# EAGLE design owl-analog (EAGLE 7.5.0)
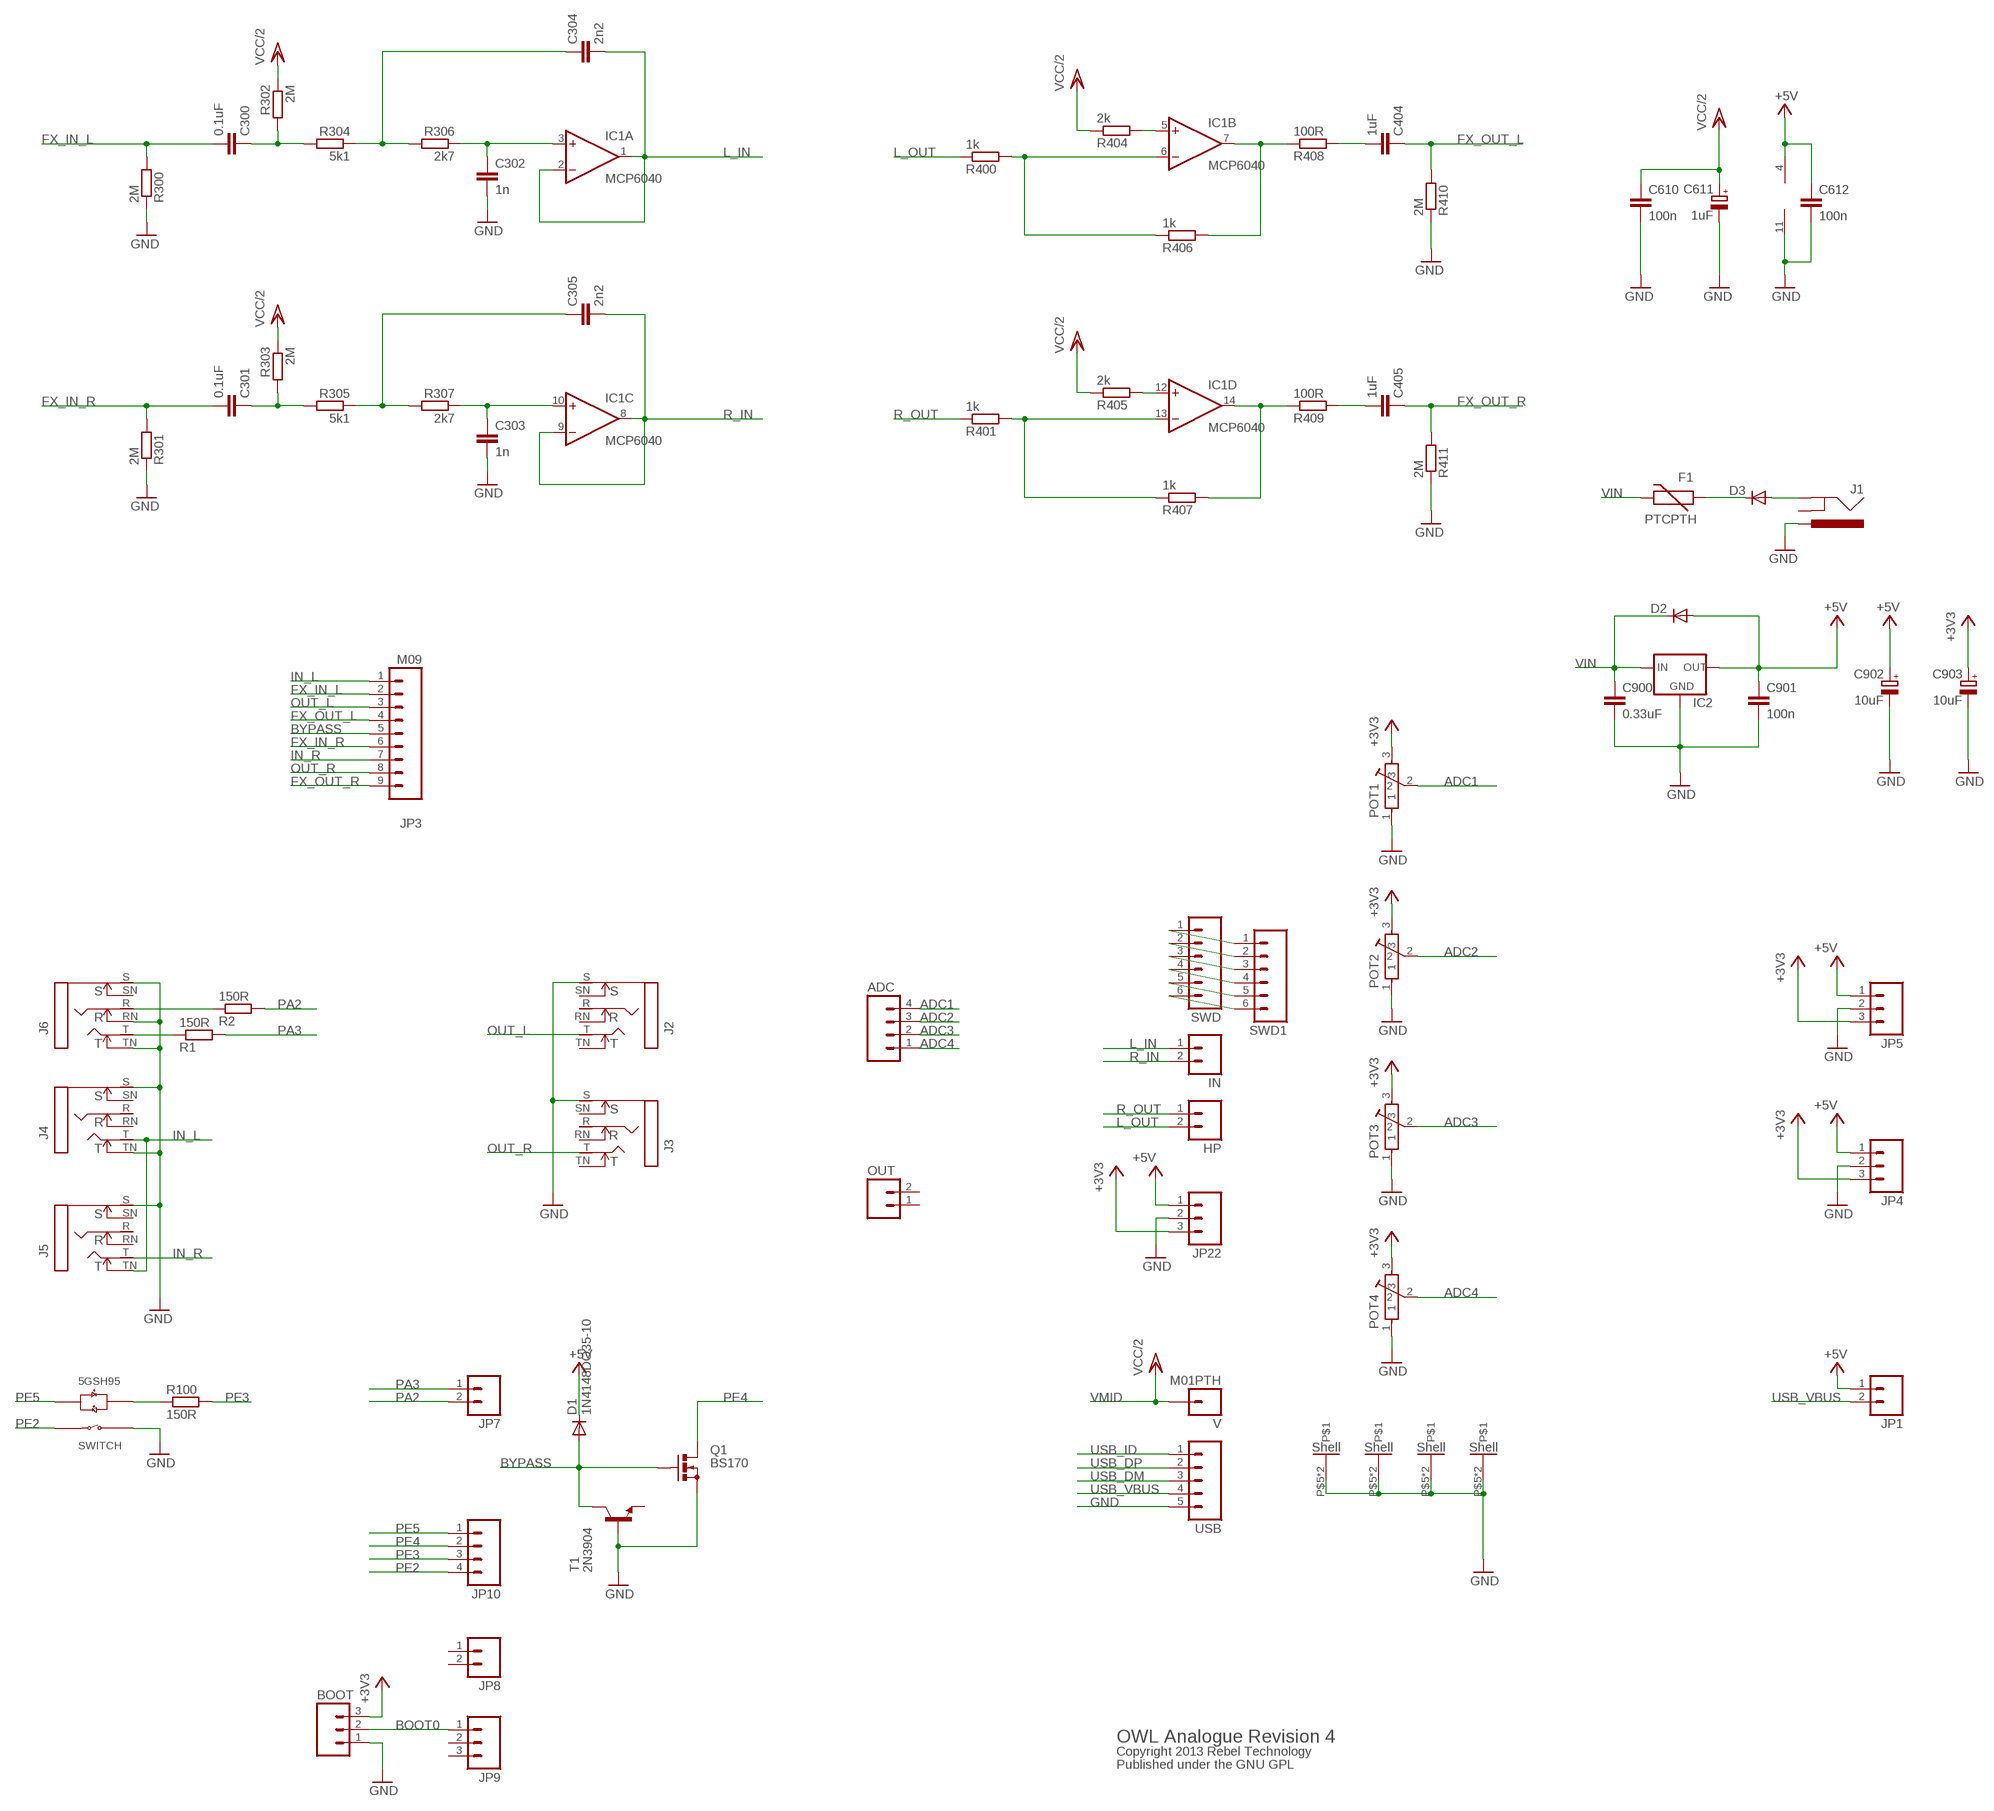
[diagram p0: schematic, sheet 1]

## Parts
ADC  M04PTH  [1X04]
BOOT  M03PTH  [1X03]
C300  0.1uF  C5/3.5  [C5B3.5]
C301  0.1uF  C5/3.5  [C5B3.5]
C302  1n  C5/2.5  [C5B2.5]
C303  1n  C5/2.5  [C5B2.5]
C304  2n2  C5/2.5  [C5B2.5]
C305  2n2  C-EU050-025X075  [C050-025X075]
C404  1uF  C5/5  [C5B5]
C405  1uF  C5/5  [C5B5]
C610  100n  C-EU050-025X075  [C050-025X075]
C611  1uF  CPOL-EUE2.5-7  [E2,5-7]
C612  100n  C-EU050-025X075  [C050-025X075]
C900  0.33uF  C-EU050-025X075  [C050-025X075]
C901  100n  C-EU050-025X075  [C050-025X075]
C902  10uF  CPOL-EUE2.5-7  [E2,5-7]
C903  10uF  CPOL-EUE2.5-7  [E2,5-7]
D1  1N4148DO35-10  [DO35-10]
D2  DIODE1N4001  [DIODE-1N4001]
D3  DIODE1N4001  [DIODE-1N4001]
F1  PTCPTH  [PTC]
HP  M02PTH  [1X02]
IC1  MCP6040  TL074P  [DIL14]
IC2  V_REG_78XX-TO-220  [TO-220-ALT]
IN  M02PTH  [1X02]
J1  POWER_JACKPTH  [POWER_JACK_PTH]
J2  NEUTRIK_NMJ6HCD2  [NMJ6HCD2]
J3  NEUTRIK_NMJ6HCD2  [NMJ6HCD2]
J4  NEUTRIK_NMJ6HCD2  [NMJ6HCD2]
J5  NEUTRIK_NMJ6HCD2  [NMJ6HCD2]
J6  NEUTRIK_NMJ6HCD2  [NMJ6HCD2]
JP1  M02PTH  [1X02]
JP3  M09  [1X09]
JP4  M03PTH  [1X03]
JP5  M03PTH  [1X03]
JP7  M02PTH  [1X02]
JP8  M02PTH  [1X02]
JP9  M03PTH  [1X03]
JP10  M04PTH  [1X04]
JP22  M03PTH  [1X03]
OUT  M02PTH  [1X02]
POT1  POT-ALPS-RK09L1140  [POT-ALPS-RK09L1140]
POT2  POT-ALPS-RK09L1140  [POT-ALPS-RK09L1140]
POT3  POT-ALPS-RK09L1140  [POT-ALPS-RK09L1140]
POT4  POT-ALPS-RK09L1140  [POT-ALPS-RK09L1140]
Q1  BS170  [SOT54E]
R1  150R  R-EU_0204/7  [0204/7]
R2  150R  R-EU_0204/7  [0204/7]
R100  150R  R-EU_0204/7  [0204/7]
R300  2M  R-EU_0204/7  [0204/7]
R301  2M  R-EU_0204/7  [0204/7]
R302  2M  R-EU_0204/7  [0204/7]
R303  2M  R-EU_0204/7  [0204/7]
R304  5k1  R-EU_0204/7  [0204/7]
R305  5k1  R-EU_0204/7  [0204/7]
R306  2k7  R-EU_0204/7  [0204/7]
R307  2k7  R-EU_0204/7  [0204/7]
R400  1k  R-EU_0204/7  [0204/7]
R401  1k  R-EU_0204/7  [0204/7]
R404  2k  R-EU_0204/7  [0204/7]
R405  2k  R-EU_0204/7  [0204/7]
R406  1k  R-EU_0204/7  [0204/7]
R407  1k  R-EU_0204/7  [0204/7]
R408  100R  R-EU_0204/7  [0204/7]
R409  100R  R-EU_0204/7  [0204/7]
R410  2M  R-EU_0204/7  [0204/7]
R411  2M  R-EU_0204/7  [0204/7]
SWD  M06SIP  [1X06]
SWD1  M06SIP  [1X06]
T1  2N3904  [TO92]
U$1  5GTH9  [5GTH9]
USB  M05PTH  [1X05]
V  M01PTH  [1X01]

## Nets
+3V3: BOOT.3 C903.+ JP4.3 JP5.3 JP22.3 POT1.3 POT2.3 POT3.3 POT4.3
+5V: C612.1 C901.1 C902.+ D1.C D2.A IC1.4(P:V+) IC2.OUT JP1.1 JP4.1 JP5.1 JP22.1
+5V/1: IC1.5(B:+IN) R404.2
ADC1: ADC.4 POT1.2
ADC2: ADC.3 POT2.2
ADC3: ADC.2 POT3.2
ADC4: ADC.1 POT4.2
BOOT0: BOOT.2 JP9.1
BYPASS: D1.A JP3.5 Q1.G T1.1(C)
FX_IN_L: C300.2 JP3.2 R300.2
FX_IN_R: C301.2 JP3.6 R301.2
FX_OUT_L: C404.1 JP3.4 R410.2
FX_OUT_R: C405.1 JP3.9 R411.2
GND: BOOT.1 C302.2 C303.2 C610.2 C611.- C612.2 C900.2 C901.2 C902.- C903.- IC1.11(P:V-) IC2.GND J1.PWR J2.S J3.S J4.S J4.TN J5.S J6.RN J6.S J6.TN JP4.2 JP5.2 JP22.2 POT1.1 POT1.P$5 POT1.P$6 POT2.1 POT2.P$5 POT2.P$6 POT3.1 POT3.P$5 POT3.P$6 POT4.1 POT4.P$5 POT4.P$6 Q1.S R300.1 R301.1 R410.1 R411.1 T1.2(B) U$1.1(SWITCH_B) USB.5
IN_L: J4.T J5.TN JP3.1
IN_R: J5.T JP3.7
L_IN: C304.2 IC1.1(A:OUT) IC1.2(A:-IN) IN.1
L_OUT: HP.2 R400.1
N$1: D3.A J1.GND
N$2: IC1.12(D:+IN) R405.2
N$3: SWD1.1 SWD.1
N$4: D3.C F1.P$1
N$5: SWD1.2 SWD.2
N$6: SWD1.3 SWD.3
N$7: SWD1.4 SWD.4
N$8: SWD1.5 SWD.5
N$9: SWD1.6 SWD.6
N$10: R100.1 U$1.+3(LED_R+)
N$12: J6.R R2.1
N$15: J6.T R1.1
N$26: C300.1 R302.2 R304.2
N$28: C405.2 R409.2
N$30: C301.1 R303.2 R305.2
N$32: C303.1 IC1.10(C:+IN) R307.1
N$33: C304.1 R304.1 R306.2
N$34: C305.1 R305.1 R307.2
N$35: C404.2 R408.2
N$36: C302.1 IC1.3(A:+IN) R306.1
N$39: IC1.7(B:OUT) R406.2 R408.1
N$40: IC1.14(D:OUT) R407.2 R409.1
N$41: IC1.6(B:-IN) R400.2 R406.1
N$42: IC1.13(D:-IN) R401.2 R407.1
OUT_L: J2.T JP3.3
OUT_R: J3.T JP3.8
PA2: JP7.2 R2.2
PA3: JP7.1 R1.2
PE2: JP10.4 U$1.4(SWITCH_A)
PE3: JP10.3 R100.2
PE4: JP10.2 Q1.D
PE5: JP10.1 U$1.-2(LED_G+)
R_IN: C305.2 IC1.8(C:OUT) IC1.9(C:-IN) IN.2
R_OUT: HP.1 R401.1
USB_DM: USB.3
USB_DP: USB.2
USB_ID: USB.1
USB_VBUS: JP1.2 USB.4
VIN: C900.1 D2.C F1.P$2 IC2.IN
VMID: C610.1 C611.+ R302.1 R303.1 R404.1 R405.1 V.1 ; supply symbol labelled VCC/2
Unconnected: J1.GNDBREAK J2.R J2.RN J2.SN J2.TN J3.R J3.RN J3.SN J3.TN J4.R J4.RN J4.SN J5.R J5.RN J5.SN J6.SN JP8.1 JP8.2 JP9.2 JP9.3 OUT.1 OUT.2 T1.3(E)

## Notes on the sheet
- OWL Analogue Revision 4
- Copyright 2013 Rebel Technology
- Published under the GNU GPL

## Library data of the parts
ADC JP10 = SparkFun:M04: Header 4 Standard 4-pin 0.1" header. Use with straight break away headers (SKU : PRT-00116), right angle break away headers (PRT-00553), swiss pins (PRT-00743), machine pins (PRT-00117), and female headers (PRT-00115). Molex polarized connector foot print use with SKU : PRT-08231 with associated crimp pins and housings. 1MM SMD Version SKU: PRT-10208
BOOT JP4 JP5 JP9 JP22 = SparkFun:M03: Header 3 Standard 3-pin 0.1" header. Use with straight break away headers (SKU : PRT-00116), right angle break away headers (PRT-00553), swiss pins (PRT-00743), machine pins (PRT-00117), and female headers (PRT-00115). Molex polarized connector foot print use with SKU : PRT-08232 with associated crimp pins and housings.
C300-C304 C404 C405 = capacitor-wima:C: CAPACITOR naming: grid - package width
C305 C610 C612 C900 C901 = rcl:C-EU: CAPACITOR, European symbol
C611 C902 C903 = rcl:CPOL-EU: POLARIZED CAPACITOR, European symbol
D1 = diode:1N4148: DIODE high speed (Philips)
D2 D3 = Rebel:DIODE: Diode These are standard reverse protection diodes and small signal diodes. SMA package can handle up to about 1A. SOD-323 can handle about 200mA. Watch the SOD-323 package when ordering, there are some mfgs out there that are 5-pin packages.
F1 = Rebel:PTC: Resettable Fuse PTC Resettable Fuse. Bourns MF-R, Raychem PolySwitch RXE.
HP IN JP1 JP7 JP8 OUT = SparkFun:M02: Header 2 Standard 2-pin 0.1" header. Use with straight break away headers (SKU : PRT-00116), right angle break away headers (PRT-00553), swiss pins (PRT-00743), machine pins (PRT-00117), and female headers (PRT-00115). Molex polarized connector foot print use with SKU : PRT-08233 with associated crimp pins and housings.
IC1 = linear:TL074: OP AMP
IC2 = SparkFun:V_REG_78XX: Voltage Regulator Standard 7805 5V regulator. IGO (Input Ground Output). Spark Fun Electronics SKU : COM-00107
J1 = SparkFun:POWER_JACK: Power Jack This is the standard 5.5mm barrel jack for power. The PTH is the most common, proven, reliable, footprint. All others are experimental. The Slot footprint only works if the mill layer is transmitted to the PCB fab house so be warned. Spark Fun Electronics SKU : PRT-00119. Mating wall wart : TOL-00298 (and others)
J2-J6 = neutrik_jacks:NEUTRIK_NMJ6HCD2
JP3 = SparkFun:M09: Header 9 Standard 9-pin 0.1" header. Use with straight break away headers (SKU : PRT-00116), right angle break away headers (PRT-00553), swiss pins (PRT-00743), machine pins (PRT-00117), and female headers (PRT-00115).
POT1-POT4 = Rebel:POT-ALPS-RK09L
Q1 = transistor-small-signal:BS170: N-CHANNEL MOS FET
R1 R2 R100 R300-R307 R400 R401 R404-R411 = Rebel:R-EU_: RESISTOR, European symbol
SWD SWD1 = SparkFun:M06: Header 6 Standard 6-pin 0.1" header. Use with straight break away headers (SKU : PRT-00116), right angle break away headers (PRT-00553), swiss pins (PRT-00743), machine pins (PRT-00117), and female headers (PRT-00115). Molex polarized connector foot print use with SKU : PRT-08094 with associated crimp pins and housings. NOTES ON THE VARIANTS LOCK and LOCK_LONGPADS... This footprint was designed to help hold the alignment of a through-hole component (i.e. 6-pin header) while soldering it into place. You may notice that each hole has been shifted either up or down by 0.005 of an inch from it's more standard position (which is a perfectly straight line). This slight alteration caused the pins (the squares in the middle) to touch the edges of the holes. Because they are alternating, it causes a "brace" to hold the component in place. 0.005 has proven to be the perfect amount of "off-center" position when using our standard breakaway headers. Although looks a little odd when you look at the bare footprint, once you have a header in there, the alteration is very hard to notice. Also, if you push a header all the way into place, it is covered up entirely on the bottom side. This idea of altering the position of holes to aid alignment will be further integrated into the Sparkfun Library for other footprints. It can help hold any component with 3 or more connection pins.
T1 = transistor:2N3904: NPN TRANSISTOR
U$1 = SWITCH-5GTH9:5GTH9
USB = SparkFun:M05: Header 5 Standard 5-pin 0.1" header. Use with straight break away headers (SKU : PRT-00116), right angle break away headers (PRT-00553), swiss pins (PRT-00743), machine pins (PRT-00117), and female headers (PRT-00115). Molex polarized connector foot print use with SKU : PRT-08230 with associated crimp pins and housings.
V = SparkFun:M01: Header 1 Standard 1-pin 0.1" header. Use with straight break away headers (SKU : PRT-00116), right angle break away headers (PRT-00553), swiss pins (PRT-00743), machine pins (PRT-00117), and female headers (PRT-00115).

## Board
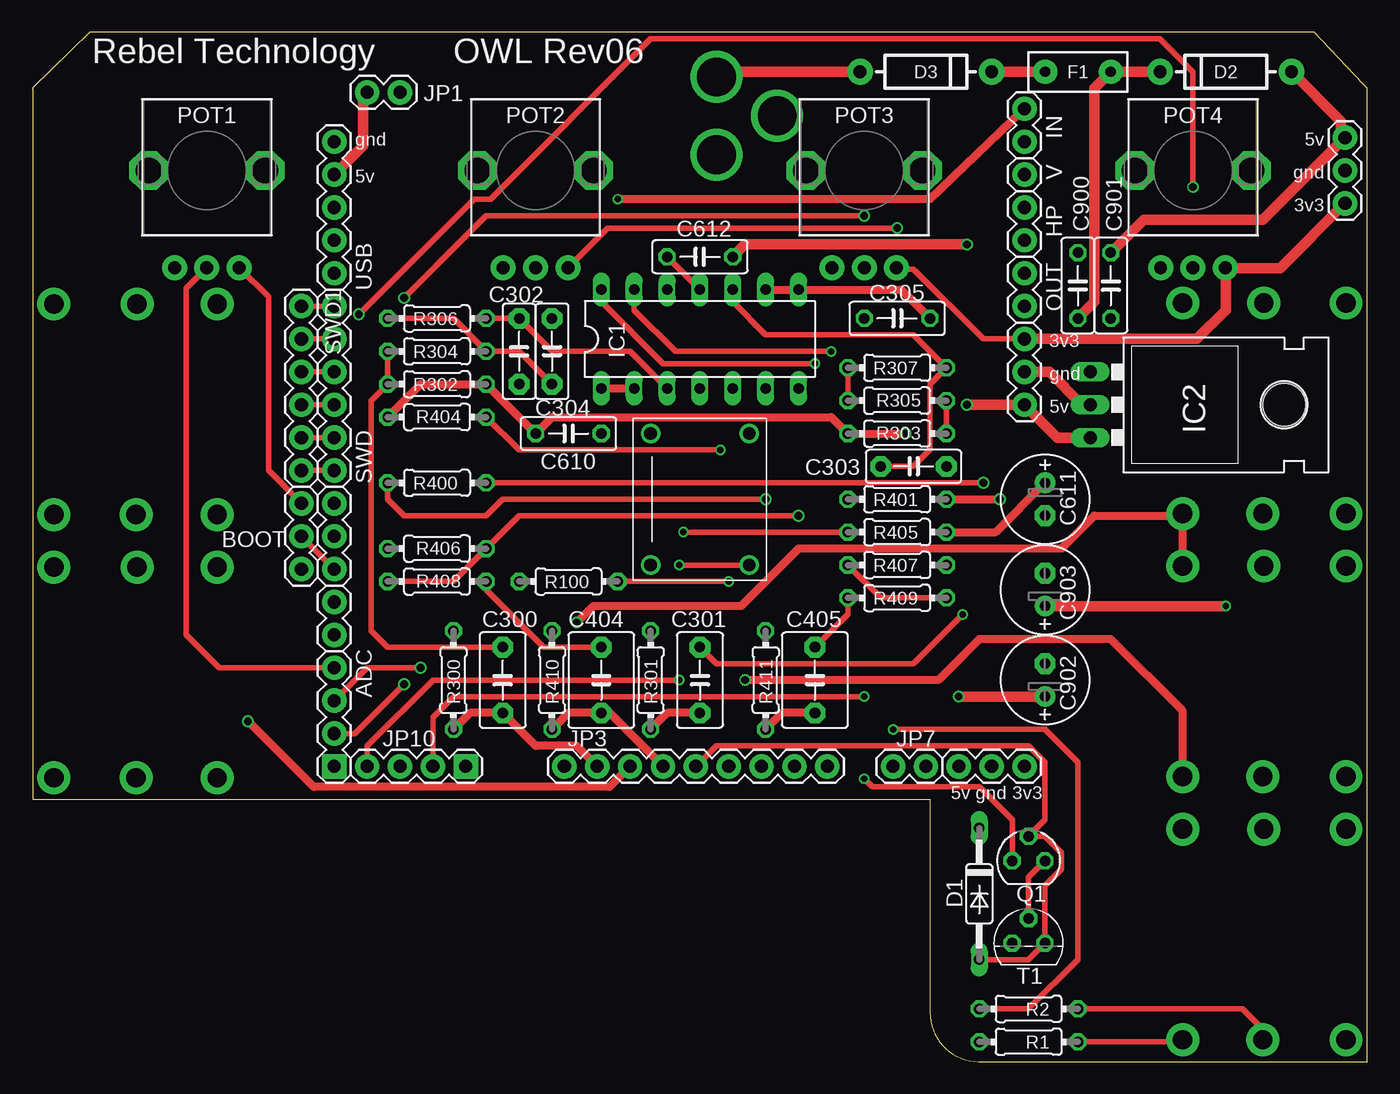
[diagram p1: board, top side]
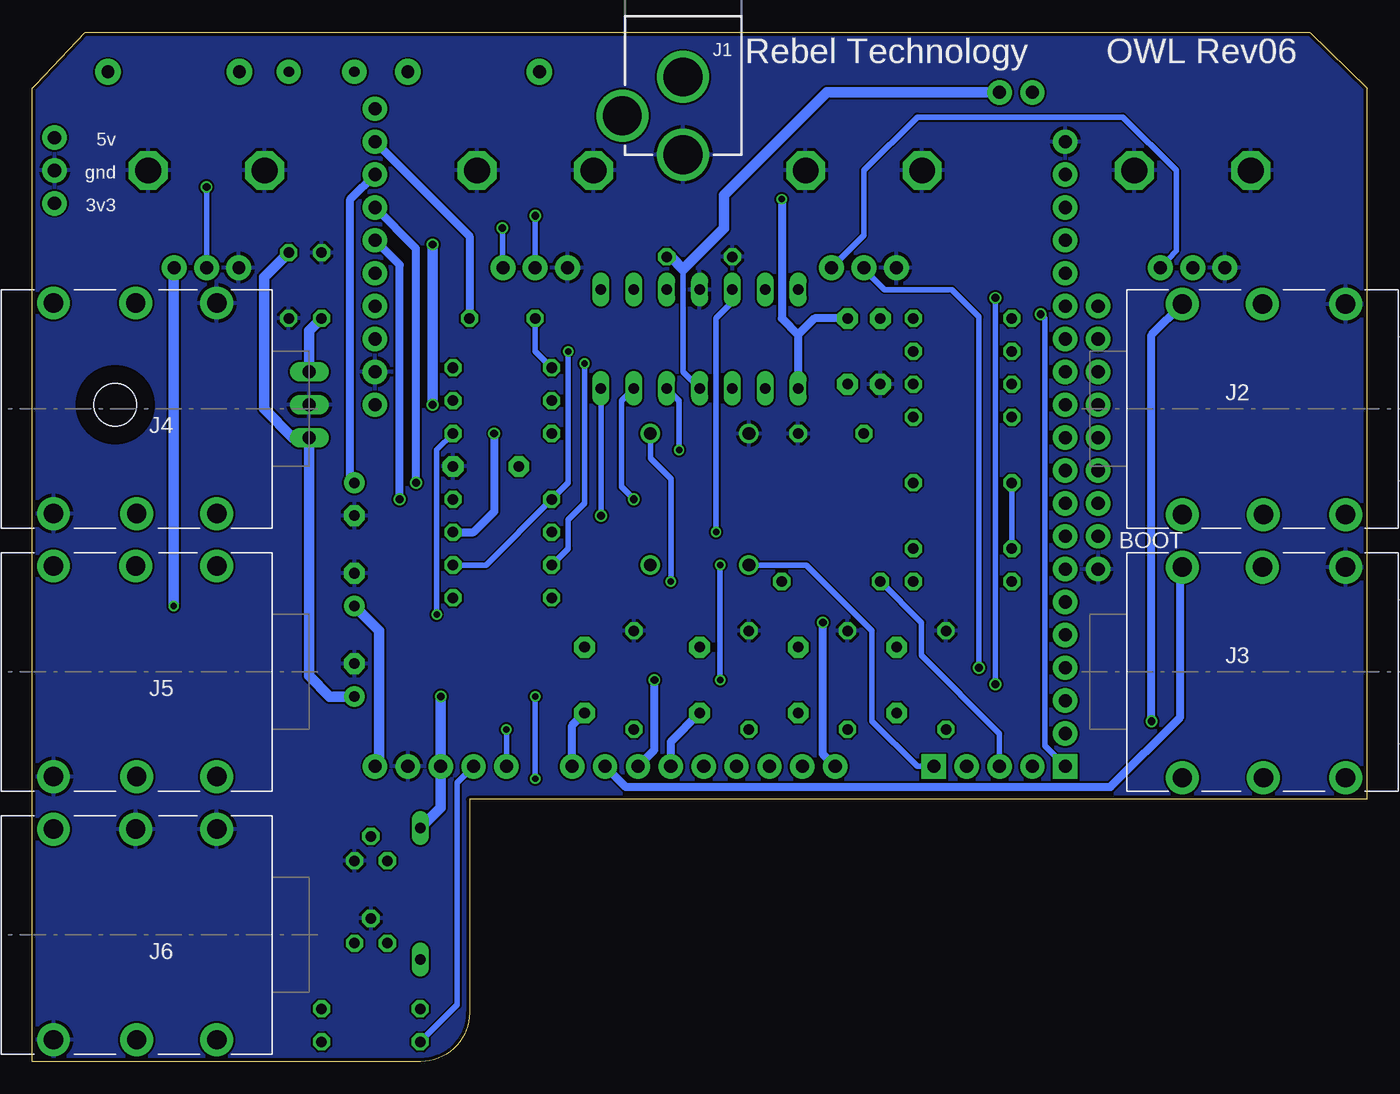
[diagram p2: board, bottom side, seen from below]

Size 103.15 x 79.5 mm. Coordinates in mm from the lower left corner, seen from the top.
Outline: 0.03,20.26 69.37,20.26 69.37,3.78 arc90 73.14,0 103.15,0 103.15,75.18 102.86,75.5 99.05,79.5 4.45,79.5 0,75.18 0.03,75.18 0.03,20.26
Copper layers (1*16): Top 0.035mm / dielectric 1.5mm / Bottom 0.035mm
Design rules "SeeedStudio_2layer_DRU_no_angle_20140221": minimum track width 6mil, minimum drill 12mil, track to track 6mil, track to pad 6mil, pad to pad 6mil, via to via 6mil, smd to smd 0mil, copper to edge 10mil, drill to drill 10mil, minimum pad ring 10mil, minimum via ring 6mil, stop-mask expansion 2mil, vias tented up to drill 100mil, thermal gap 10mil

### Footprints (pad centres in the part's own frame; a part is rotated, then mirrored left to right if it is on the bottom)
1X04 = drill 1.016 pad 1.88 square: 1 0,0 | drill 1.016 pad 1.88: 2 2.54,0; 3 5.08,0; 4 7.62,0
1X03 = drill 1.016 pad 1.88: 1 0,0; 2 2.54,0; 3 5.08,0
C5B3.5 = drill 0.813 pad 1.6 octagon: 1 -2.54,0; 2 2.54,0
C5B2.5 = drill 0.813 pad 1.6 octagon: 1 -2.54,0; 2 2.54,0
C050-025X075 = drill 0.813 octagon: 1 -2.54,0; 2 2.54,0
C5B5 = drill 0.813 pad 1.6 octagon: 1 -2.54,0; 2 2.54,0
E2,5-7 = drill 0.813 pad 1.6: + -1.27,0 | drill 0.813 pad 1.6 octagon: - 1.27,0
DO35-10 = drill 0.813 long: A 5.08,0; C -5.08,0
DIODE-1N4001 = drill 1 pad 1.981: A -5.08,0; C 5.08,0
PTC = drill 0.8 pad 1.88: P$1 -2.54,0; P$2 2.54,0
1X02 = drill 1.016 pad 1.88: 1 0,0; 2 2.54,0
DIL14 = drill 0.813 long: 1 -7.62,-3.81; 2 -5.08,-3.81; 3 -2.54,-3.81; 4 0,-3.81; 5 2.54,-3.81; 6 5.08,-3.81; 7 7.62,-3.81; 8 7.62,3.81; 9 5.08,3.81; 10 2.54,3.81; 11 0,3.81; 12 -2.54,3.81; 13 -5.08,3.81; 14 -7.62,3.81
TO-220-ALT = drill 1.016 long: GND 0,-3.81; IN -2.54,-3.81; OUT 2.54,-3.81 | hole 3.302: 0,11.176
POWER_JACK_PTH = drill 2.997: GND 0,7.7; GNDBREAK 4.7,10.7; PWR 0,13.7
NMJ6HCD2 = drill 1.5 pad 2.54: R -0.318,8.096; RN -0.238,-8.176; S 6.112,8.096; SN 6.112,-8.176; T -6.509,8.096; TN -6.509,-8.176
1X09 = drill 1.016 pad 1.88: 1 0,0; 2 2.54,0; 3 5.08,0; 4 7.62,0; 5 10.16,0; 6 12.7,0; 7 15.24,0; 8 17.78,0; 9 20.32,0
POT-ALPS-RK09L1140 = drill 1 pad 1.93: 1 -2.5,-7.5; 2 0,-7.5; 3 2.5,-7.5 | drill 2 octagon: P$5 -4.5,0; P$6 4.5,0
SOT54E = drill 0.813 octagon: D -1.27,0; G 0,1.905; S 1.27,0
0204/7 = drill 0.813 octagon: 1 -3.81,0; 2 3.81,0
1X06 = drill 1.016 pad 1.88: 1 0,0; 2 2.54,0; 3 5.08,0; 4 7.62,0; 5 10.16,0; 6 12.7,0
TO92 = drill 0.813 octagon: 1 1.27,0; 2 0,1.905; 3 -1.27,0
5GTH9 = drill 1: 1 5.08,3.81; 4 -5.08,-3.81; +3 5.08,-3.81; -2 -5.08,3.81
1X05 = drill 1.016 pad 1.88: 1 0,0; 2 2.54,0; 3 5.08,0; 4 7.62,0; 5 10.16,0
1X01 = drill 1.016 pad 1.88: 1 0,0

### Placement (x,y rotation side)
ADC  23.33,22.8 90 top
BOOT  20.79,38.04 90 top
C300  36.35,29.46 270 top
C301  51.59,29.46 270 top
C302  37.62,54.86 270 top
C303  68.1,45.97 0 top
C304  40.16,54.86 90 top
C305  66.83,57.4 0 top
C404  43.97,29.46 90 top
C405  60.48,29.46 90 top
C610  41.43,48.51 0 top
C611  78.26,43.43 270 top
C612  51.59,62.17 180 top
C900  80.8,59.94 90 top
C901  83.34,59.94 270 top
C902  78.26,29.46 90 top
C903  78.26,36.45 90 top
D1  73.18,12.95 270 top
D2  92.23,76.45 180 top
D3  69.05,76.45 0 top
F1  80.8,76.45 0 top
HP  76.67,63.44 90 top
IC1  51.59,55.82 0 top
IC2  85.56,50.74 270 top
IN  76.67,73.6 270 top
J1  52.86,83.76 180 bottom
J2  7.77,50.42 0 bottom
J3  7.77,30.1 0 bottom
J4  95.4,50.42 180 bottom
J5  95.4,30.1 180 bottom
J6  95.4,9.78 180 bottom
JP1  28.41,74.87 180 top
JP3  41.11,22.8 0 top
JP4  101.43,71.37 270 top
JP5  71.59,22.8 0 top
JP7  69.05,22.8 180 top
JP8  23.33,32.96 90 top
JP9  23.33,38.04 90 top
JP10  33.49,22.8 180 top
JP22  76.67,50.74 90 top
OUT  76.67,60.9 270 top
POT1  13.49,68.83 0 top
POT2  38.89,68.83 0 top
POT3  64.29,68.83 0 top
POT4  89.69,68.83 0 top
Q1  76.99,15.49 0 top
R1  76.99,1.52 180 top
R2  76.99,4.06 180 top
R100  41.43,37.08 180 top
R300  32.54,29.46 270 top
R301  47.78,29.46 270 top
R302  31.27,52.32 180 top
R303  66.83,48.51 0 top
R304  31.27,54.86 180 top
R305  66.83,51.05 0 top
R306  31.27,57.4 180 top
R307  66.83,53.59 180 top
R400  31.27,44.7 180 top
R401  66.83,43.43 180 top
R404  31.27,49.78 0 top
R405  66.83,40.89 180 top
R406  31.27,39.62 0 top
R407  66.83,38.35 180 top
R408  31.27,37.08 0 top
R409  66.83,35.81 180 top
R410  40.16,29.46 270 top
R411  56.67,29.46 270 top
SWD  23.33,58.36 270 top
SWD1  20.79,58.36 270 top
T1  76.99,9.14 0 top
U$1  51.59,43.43 90 top
USB  23.33,60.9 90 top
V  76.67,68.52 90 top

### Tracks (layer width: path | path; a pad name or v marks a point on that pad's centre or on a via)
+3V3  (via drill 0.5, 0.6)
  Top 0.406: 92.23,61.29 POT4.3 | JP22.3 73.49,55.82 68.1,61.21 66.91,61.21 POT3.3 | v66.83,64.39 44.44,64.39 POT2.3 | BOOT.3 18.25,45.66 18.25,59.07 POT1.3
  Top 0.813: C903.+ v92.23,35.18 | JP22.3 90.01,55.82 92.23,58.04 92.23,61.29 96.43,61.29 JP4.3
  Bottom 0.406: POT3.3 66.79,61.17 66.83,62.48 v66.83,64.39 | POT1.3 14.76,62.64 14.76,68.83 18.89,72.96 34.76,72.96 38.89,68.83 38.89,63.83 POT2.3
  Bottom 0.813: JP5.3 76.35,23.43 76.35,33.27 C903.+ | v92.23,35.18 92.23,61.29 POT4.3
+5V  (via drill 0.6)
  Top 0.813: IC2.OUT 79.21,48.2 JP22.1 v72.23,50.74 | C901.1 85.88,65.02 95.08,65.02 JP4.1 101.12,71.37 101.12,72.64 D2.A | C612.1 55.08,63.12 v72.23,63.12 | v71.59,28.19 C902.+
  Bottom 0.406: 52.86,61.21 52.86,53.28 IC1.4
  Bottom 0.813: D1.C 71.59,19.62 JP5.1 v71.59,28.19 | C901.1 85.24,60.58 85.24,50.42 83.02,48.2 IC2.OUT 81.75,29.78 80.16,28.19 C902.+ | JP1.1 41.75,74.87 49.68,66.93 49.68,64.39 52.86,61.21 53.81,62.17 C612.1 | v72.23,63.12 v72.23,50.74
+5V/1  (via drill 0.5)
  Top 0.406: R404.2 37.62,47.24 v53.18,47.24
  Bottom 0.406: v53.18,47.24 53.18,51.05 IC1.5
ADC1
  Top 0.406: ADC.4 14.44,30.42 11.9,32.96 11.9,59.75 POT1.2
ADC2  (via drill 0.6)
  Top 0.406: ADC.3 25.87,30.42 v30,30.42
  Bottom 0.406: v30,30.42 30,57.52 32.1,59.63 37.3,59.63 38.89,61.21 POT2.2
ADC3  (via drill 0.6)
  Top 0.406: v64.29,65.34 35.08,65.34 v28.73,58.99 | ADC.2 24.92,25.34 v28.73,29.15
  Bottom 0.406: v28.73,29.15 v28.73,58.99 | v64.29,65.34 POT3.2
ADC4  (via drill 0.6)
  Top 0.406: v25.24,57.72 34.12,66.61 35.4,66.61 47.78,78.99 87.15,78.99 89.69,76.45 v89.69,67.56
  Bottom 0.406: v25.24,57.72 24.92,57.4 24.92,24.38 ADC.1 | v89.69,67.56 POT4.2
BOOT0
  Top 0.406: JP9.1 BOOT.2
BYPASS
  Top 0.406: D1.A 76.99,7.87 T1.1 78.26,13.59 79.53,14.86 79.53,16.13 78.26,17.4 Q1.G 78.26,18.67 78.26,23.11 76.99,24.38 52.86,24.38 JP3.5
FX_IN_L
  Top 0.61: R300.2 33.81,26.92 C300.2 38.89,24.38 42.06,24.38 JP3.2
FX_IN_R
  Top 0.61: C301.2 49.05,26.92 R301.2
  Bottom 0.61: JP3.6 53.81,24.7 C301.2
FX_OUT_L
  Top 0.61: R410.2 41.43,26.92 C404.1 44.6,26.92 JP3.4
FX_OUT_R
  Top 0.61: C405.1 57.94,26.92 R411.2
  Bottom 0.61: JP3.9 61.43,25.97 C405.1
GND
  Top 0.406: T1.2 76.99,14.22 Q1.S | C612.2 IC1.11
  Top 0.813: IC2.GND 81.12,50.74 78.57,53.28 JP22.2
  pour Bottom: -5.56,19.94 -6.83,82.17 109.69,82.17 109.69,-1.65 66.83,-1.65 66.83,19.94
IN_L  (via drill 0.6)
  Top 0.61: J5.TN J4.T 88.74,42.16 82.07,42.16 79.53,39.62 59.21,39.62 54.76,35.18 43.33,35.18 v42.06,33.91
  Bottom 0.61: JP3.1 42.06,23.75 v42.06,33.91
IN_R  (via drill 0.6)
  Top 0.61: J5.T 88.89,27.08 83.34,32.64 73.18,32.64 70,29.46 v55.08,29.46
  Bottom 0.61: JP3.7 55.08,24.07 v55.08,29.46
L_IN  (via drill 0.5)
  Top 0.61: IC1.1 IC1.2 | IN.1 69.37,66.61 v45.24,66.61
  Bottom 0.61: C304.2 42.7,57.4 43.97,56.13 | 43.97,56.13 IC1.1 | v45.24,66.61 45.24,57.4 43.97,56.13
L_OUT  (via drill 0.6)
  Top 0.406: R400.1 v73.49,44.7
  Bottom 0.61: v73.49,44.7 73.49,62.8 HP.2
N$1
  Top 0.813: D3.A 53.26,76.45 J1.GND
N$2  (via drill 0.5)
  Top 0.406: v50.32,40.89 R405.2
  Bottom 0.406: IC1.12 49.05,58.67 50.32,57.4 v50.32,40.89
N$3
  Top 0.406: SWD1.1 SWD.1
N$4
  Top 0.813: F1.P$1 D3.C
N$5
  Top 0.406: SWD.2 SWD1.2
N$6
  Top 0.406: SWD1.3 SWD.3
N$7
  Top 0.406: SWD.4 SWD1.4
N$8
  Top 0.406: SWD1.5 SWD.5
N$9
  Top 0.406: SWD.6 SWD1.6
N$10  (via drill 0.5)
  Top 0.406: v53.81,37.08 R100.1
  Bottom 0.406: U$1.+3 55.4,46.61 53.81,45.02 v53.81,37.08
N$12
  Top 0.406: J6.R 95.08,2.48 93.5,4.06 R2.1
N$15
  Top 0.406: R1.1 88.74,1.52 J6.T
N$26
  Top 0.406: C300.1 27.46,32 26.19,33.27 26.19,51.05 R302.2 R304.2
N$28
  Top 0.406: C405.2 63.02,34.54 R409.2
N$30  (via drill 0.5)
  Top 0.406: C301.1 52.86,30.73 68.1,30.73 v71.91,34.54 | R303.2 R305.2
  Bottom 0.406: v71.91,34.54 71.91,47.24 R303.2
N$32
  Top 0.406: IC1.10 54.13,58.67 56.67,56.13 68.1,56.13 R307.1 69.37,52.32 69.37,47.24 68.1,45.97 C303.1
N$33
  Top 0.406: R306.2 32.54,57.4 R304.1 37.62,54.86 C304.1
N$34
  Top 0.406: R305.1 R307.2
  Bottom 0.406: C305.1 64.29,54.86 R307.2
N$35
  Top 0.406: C404.2 39.52,32 35.08,36.45 R408.2
N$36
  Top 0.406: R306.1 C302.1 40.16,54.86 46.19,54.86 IC1.3
N$39  (via drill 0.6)
  Top 0.406: R408.1 32.54,37.08 R406.2 37.62,42.16 v59.21,42.16
  Bottom 0.406: v59.21,42.16 IC1.7
N$40  (via drill 0.5)
  Top 0.406: v60.48,53.91 48.73,53.91 43.97,58.67 IC1.14 | R407.2 65.56,35.81 R409.1
  Bottom 0.406: v60.48,53.91 60.48,43.12 61.75,41.85 61.75,39.62 R407.2
N$41  (via drill 0.6)
  Top 0.406: v56.67,43.43 36.35,43.43 35.08,42.16 28.73,42.16 27.46,43.43 R400.2
  Bottom 0.406: v56.67,43.43 57.62,44.39 57.62,51.05 IC1.6 | R406.1 R400.2
N$42  (via drill 0.5)
  Top 0.406: IC1.13 46.51,58.04 49.68,54.86 v61.75,54.86
  Bottom 0.406: v61.75,54.86 61.75,44.7 R401.2 68.1,38.35 R407.1
OUT_L  (via drill 0.6)
  Top 0.61: JP3.3 44.6,21.21 21.74,21.21 v16.66,26.29
  Bottom 0.61: v16.66,26.29 16.66,56.13 J2.T | J2.T
OUT_R
  Bottom 0.61: JP3.8 57.3,21.21 19.84,21.21 14.44,26.61 14.44,38.04 J3.T
PA2  (via drill 0.5)
  Top 0.406: v66.51,25.65 78.26,25.65 80.8,23.11 80.8,7.87 76.99,4.06 R2.2
  Bottom 0.406: v66.51,25.65 JP7.2
PA3
  Bottom 0.406: R1.2 70.32,4.38 70.32,21.53 JP7.1
PE2  (via drill 0.5)
  Top 0.406: v50,29.46 30.95,29.46 25.87,24.38 JP10.4 | v50,38.35 U$1.4
  Bottom 0.406: v50,29.46 v50,38.35
PE3
  Bottom 0.406: JP10.3 28.41,25.34 34.44,31.37 34.44,33.91 R100.2
PE4  (via drill 0.5)
  Top 0.406: Q1.D 75.72,18.67 73.18,21.21 64.92,21.21 v64.29,21.84 | v64.29,28.19 32.54,28.19 30.95,26.61 JP10.2
  Bottom 0.406: v64.29,21.84 v64.29,28.19
PE5
  Bottom 0.406: JP10.1 34.76,22.8 38.25,26.29 38.25,33.27 43.33,38.35 U$1.-2
R_IN
  Top 0.61: IC1.9 IC1.8 67.15,59.63 C305.2
  Bottom 0.61: IN.2 69.37,63.75 C305.2
R_OUT  (via drill 0.6)
  Top 0.61: R401.1 v74.77,43.43
  Bottom 0.61: v74.77,43.43 74.77,61.53 HP.1
USB_VBUS
  Top 0.813: USB.4 25.55,70.74 25.55,74.55 JP1.2
VIN
  Top 0.813: C900.1 82.07,58.67 82.07,75.18 F1.P$2 D2.C
  Bottom 0.813: IC2.IN 81.75,56.45 C900.1
VMID  (via drill 0.6)
  Top 0.61: R404.1 30,52.32 R302.1 C610.1 40.16,49.78 61.75,49.78 R303.1 v67.46,48.51 | R405.1 74.45,40.89 C611.+
  Bottom 0.61: V.1 78.57,66.61 78.57,45.02 C611.+ | R405.1 69.05,40.89 67.46,42.48 v67.46,48.51

### Text on the board
tPlace: Rebel Technology | OWL Rev06 | gnd | 5v | 5v | gnd | 3v3 | 3v3 | gnd | 5v | 5v | gnd | 3v3
bPlace: OWL Rev06 | Rebel Technology | 5v | gnd | 3v3 | BOOT